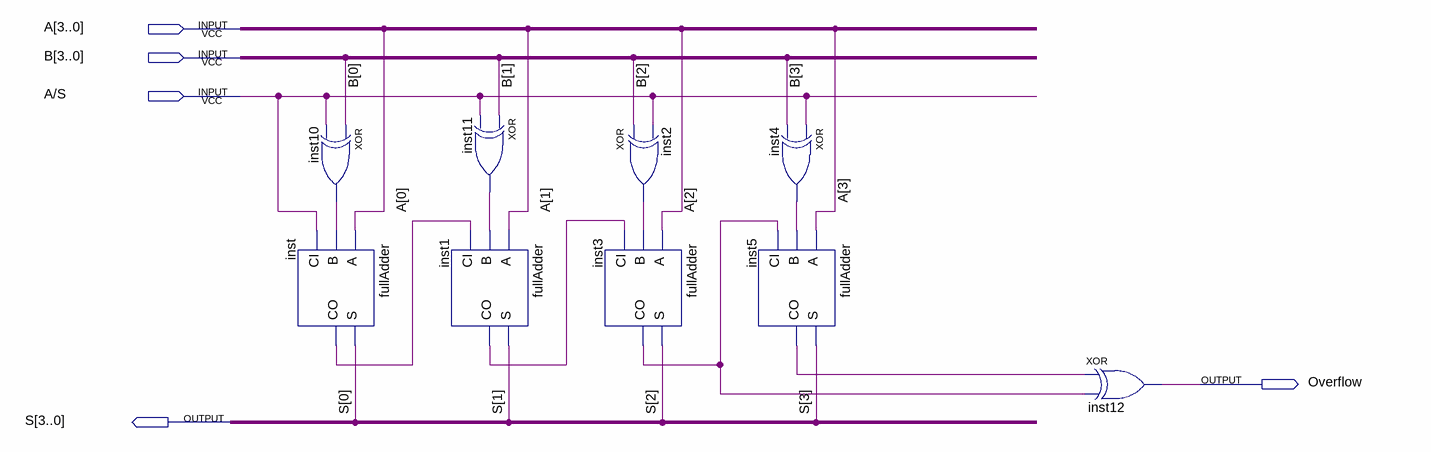
[diagram p0: schematic sheet]
// Quartus schematic AddSub.bdf as structural Verilog: 9 symbols, 5 pins
module AddSub (
  input  [3:0] A,
  input  [3:0] B,
  input  \A/S ,
  output Overflow,
  output [3:0] S
);

  wire inst1_co, inst2_out, inst3_co, inst4_out, inst5_co, inst10_out, inst11_out, inst_co;

  xor inst10 (inst10_out, B[0], \A/S );
  fullAdder inst (.A(A[0]), .B(inst10_out), .CI(\A/S ), .S(S[0]), .CO(inst_co));
  xor inst11 (inst11_out, B[1], \A/S );
  fullAdder inst1 (.A(A[1]), .B(inst11_out), .CI(inst_co), .S(S[1]), .CO(inst1_co));
  xor inst2 (inst2_out, B[2], \A/S );
  fullAdder inst3 (.A(A[2]), .B(inst2_out), .CI(inst1_co), .S(S[2]), .CO(inst3_co));
  xor inst4 (inst4_out, \A/S , B[3]);
  fullAdder inst5 (.A(A[3]), .B(inst4_out), .CI(inst3_co), .S(S[3]), .CO(inst5_co));
  xor inst12 (Overflow, inst5_co, inst3_co);
endmodule
